# Altium schematic sheet projet_pcb_bluepill_f103.SchDoc
size A2
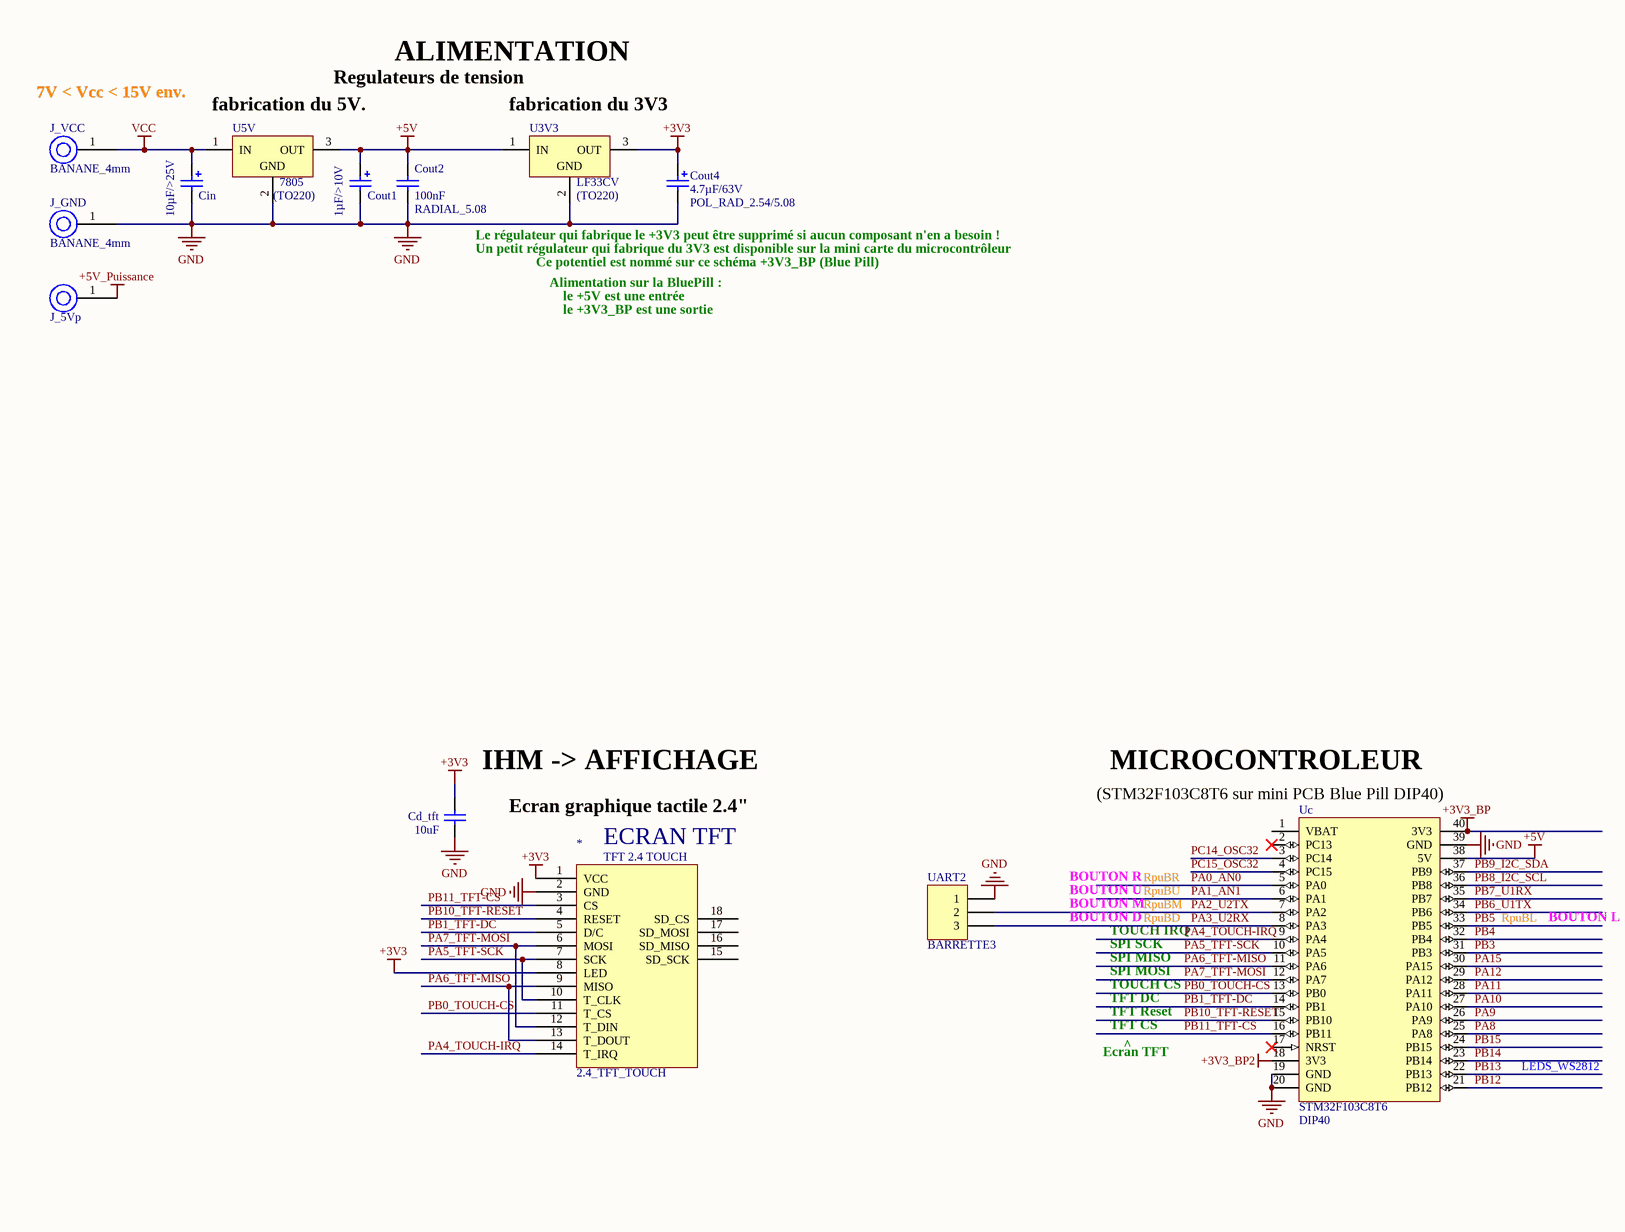
[diagram p0: projet_pcb_bluepill_f103.SchDoc, left]
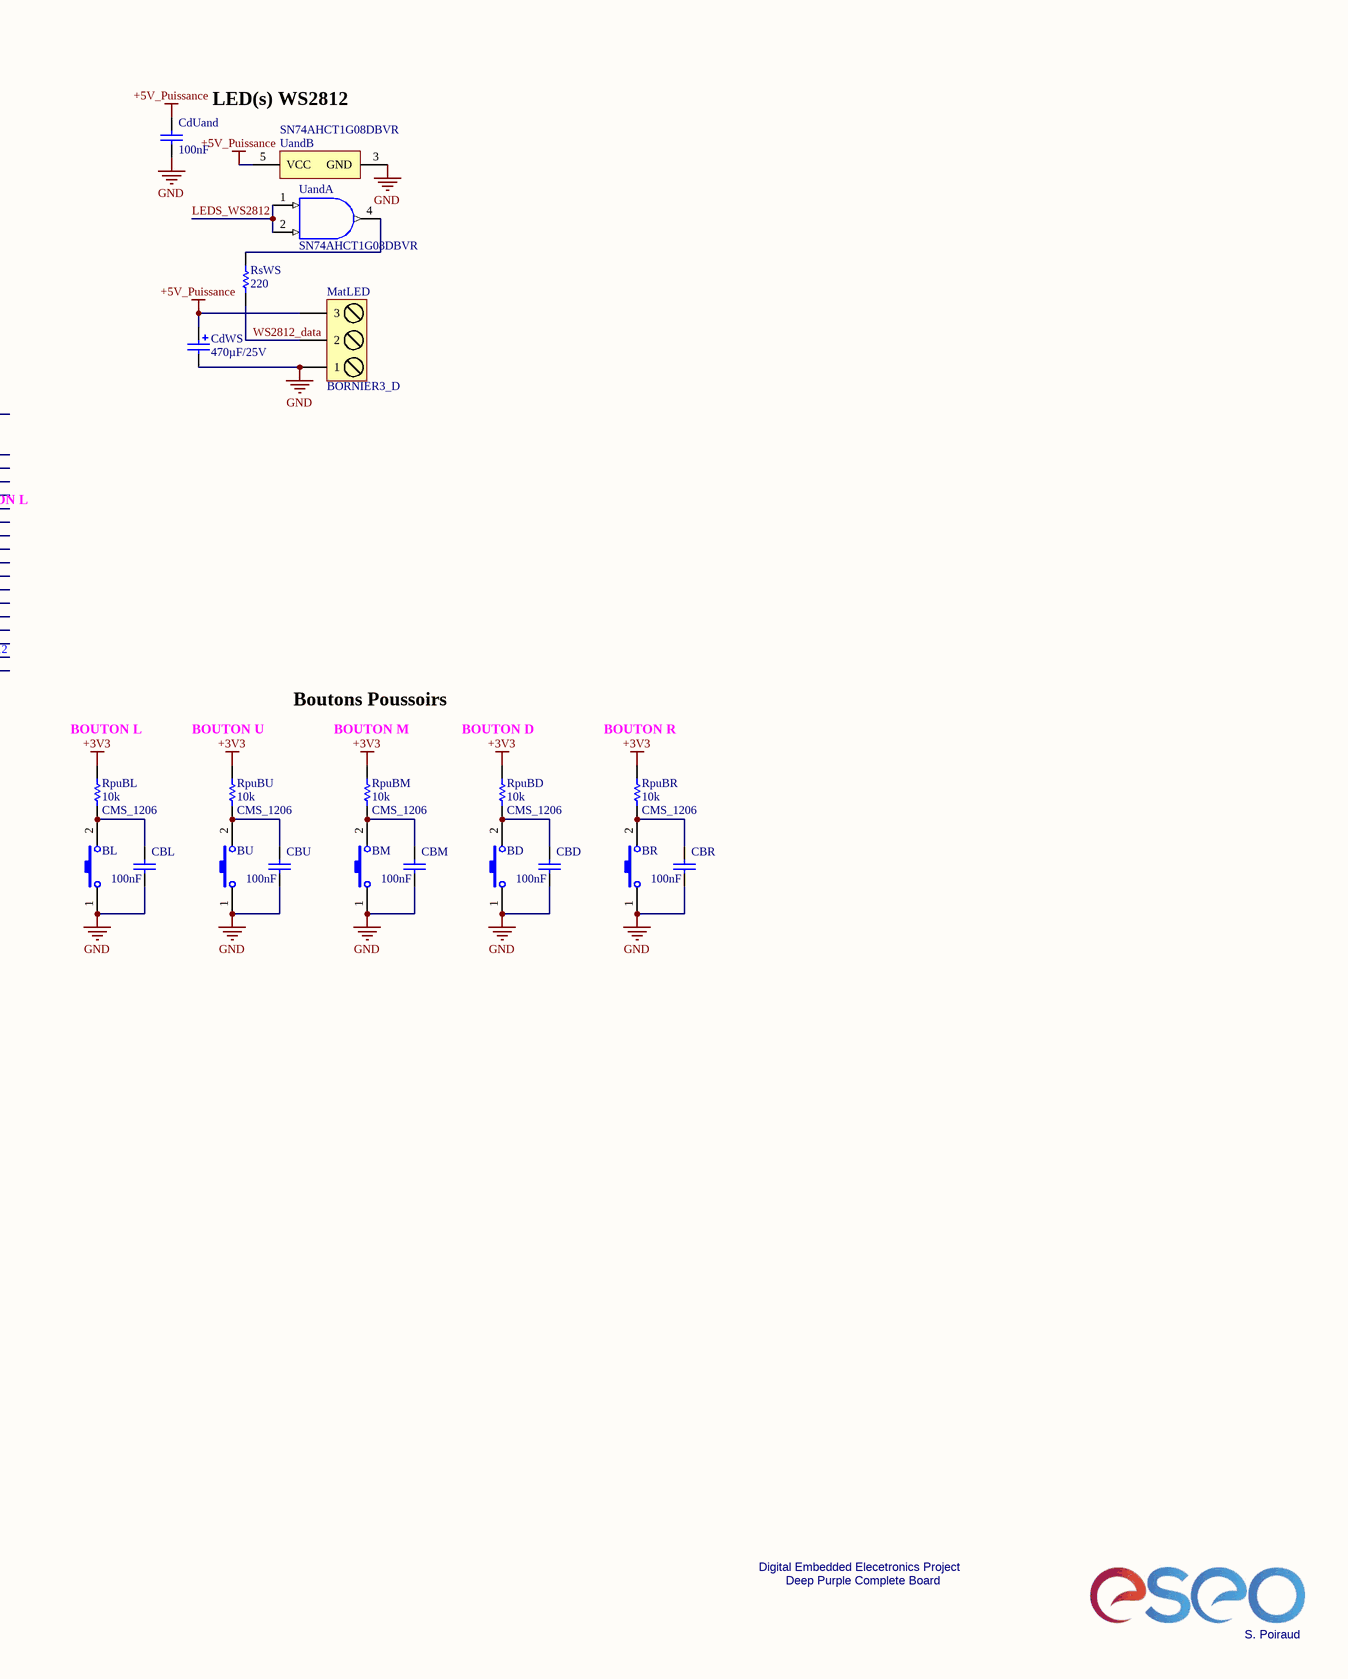
[diagram p1: projet_pcb_bluepill_f103.SchDoc, right]

## Parts
*  2.4_TFT_TOUCH  [2.4_TFT_TOUCH]
BD  BOUTON_POUSSOIR_MINIATURE_TRAVERSANT  [BOUTON_POUSSE_PLAT_6x6]  (value not drawn)
BL  BOUTON_POUSSOIR_MINIATURE_TRAVERSANT  [BOUTON_POUSSE_PLAT_6x6]  (value not drawn)
BM  BOUTON_POUSSOIR_MINIATURE_TRAVERSANT  [BOUTON_POUSSE_PLAT_6x6]  (value not drawn)
BR  BOUTON_POUSSOIR_MINIATURE_TRAVERSANT  [BOUTON_POUSSE_PLAT_6x6]  (value not drawn)
BU  BOUTON_POUSSOIR_MINIATURE_TRAVERSANT  [BOUTON_POUSSE_PLAT_6x6]  (value not drawn)
CBD  value 100nF  [C0805_N]  (hidden comment: Condensateur 0805)
CBL  value 100nF  [C0805_N]  (hidden comment: Condensateur 0805)
CBM  value 100nF  [C0805_N]  (hidden comment: Condensateur 0805)
CBR  value 100nF  [C0805_N]  (hidden comment: Condensateur 0805)
CBU  value 100nF  [C0805_N]  (hidden comment: Condensateur 0805)
Cd_tft  10uF  [CONDENSATEUR_POLARISE_ELECTROLYTIQUE_RADIAL_2.54/5.08]
CdUand  value 100nF  [C0805_N]  (hidden comment: CONDENSATEUR_CER_RAD_5.08)
CdWS  value 470µF/25V  [CONDENSATEUR_POLARISE_ELECTROLYTIQUE_RADIAL_5.08/10.16]  (hidden comment: CONDENSATEUR_POL_ELECTROLY_RAD_5.08/10.16)
Cin  value 10µF/>25V  [CONDENSATEUR_POLARISE_ELECTROLYTIQUE_RADIAL_2.0/5.08]  (hidden comment: CONDENSATEUR_POL_ELECTROLY_RAD_2.0/5.08)
Cout1  value 1µF/>10V  [CONDENSATEUR_POLARISE_ELECTROLYTIQUE_RADIAL_2.0/5.08]  (hidden comment: CONDENSATEUR_POL_ELECTROLY_RAD_2.0/5.08)
Cout2  value 100nF  Type: RADIAL_5.08  [CONDENSATEUR_CERAMIQUE_RADIAL_5.08]  (hidden comment: CONDENSATEUR_CER_RAD_5.08)
Cout4  value 4.7µF/63V  Type: POL_RAD_2.54/5.08  [CONDENSATEUR_POLARISE_ELECTROLYTIQUE_RADIAL_2.54/5.08]  (hidden comment: CONDENSATEUR_POL_ELECTROLY_RAD_2.54/5.08)
J_5Vp  DOUILLE BANANE 4mm  [DOUILLE_BANANE_4mm]  (value not drawn)
J_GND  Type: BANANE_4mm  [DOUILLE_BANANE_4mm]  (hidden comment: DOUILLE BANANE 4mm)
J_VCC  Type: BANANE_4mm  [DOUILLE_BANANE_4mm]  (hidden comment: DOUILLE BANANE 4mm)
MatLED  Type: BORNIER3_D  [BORNIER3_A_VIS]  (hidden comment: BORNIER3 DROIT A VIS)
RpuBD  value 10k  Type: CMS_1206  [RESISTANCE_CMS_1206]  (hidden comment: RESISTANCE_CMS_1206)
RpuBL  value 10k  Type: CMS_1206  [RESISTANCE_CMS_1206]  (hidden comment: RESISTANCE_CMS_1206)
RpuBM  value 10k  Type: CMS_1206  [RESISTANCE_CMS_1206]  (hidden comment: RESISTANCE_CMS_1206)
RpuBR  value 10k  Type: CMS_1206  [RESISTANCE_CMS_1206]  (hidden comment: RESISTANCE_CMS_1206)
RpuBU  value 10k  Type: CMS_1206  [RESISTANCE_CMS_1206]  (hidden comment: RESISTANCE_CMS_1206)
RsWS  220  [R1206_N]
U3V3  Type: LF33CV  Package: (TO220)  [REGULATEUR_TO220_78XX]  (hidden comment: REGULATEUR_TO220_78XX)
U5V  Type: 7805  Package: (TO220)  [REGULATEUR_TO220_78XX]  (hidden comment: REGULATEUR_TO220_78XX)
Uand  SN74AHCT1G08DBVR  [DBV0005A_N]  (parts A,B of 2)
UART2  BARRETTE3  [HDR1X3]
Uc  Type: STM32F103C8T6  Package: DIP40  [STM32F103C8T6_DIP40]  (hidden comment: STM32F103C8T6/PCB_DIP40)

## Nets
+3V3: *.1(VCC) *.8(LED) Cd_tft.1 Cout4.1 RpuBD.2 RpuBL.2 RpuBM.2 RpuBR.2 RpuBU.2 U3V3.3(OUT)
+3V3_BP: Uc.40(3V3)
+3V3_BP2: Uc.18(3V3)
+5V: Cout1.1 Cout2.2 U3V3.1(IN) U5V.3(OUT) Uc.38(5V)
+5V_Puissance: CdUand.2 CdWS.1 J_5Vp.1 MatLED.3 Uand.5(VCC)
GND: *.2(GND) BD.1 BL.1 BM.1 BR.1 BU.1 CBD.1 CBL.1 CBM.1 CBR.1 CBU.1 Cd_tft.2 CdUand.1 CdWS.2 Cin.2 Cout1.2 Cout2.1 Cout4.2 J_GND.1 MatLED.1 U3V3.2(GND) U5V.2(GND) Uand.3(GND) UART2.1 Uc.19(GND) Uc.20(GND) Uc.39(GND)
VCC: Cin.1 J_VCC.1 U5V.1(IN)
LEDS_WS2812: Uand.1(A) Uand.2(B) Uc.22(PB13)  [also labelled PB13]
PA0_AN0: Uc.5(PA0)  [also labelled RpuBR]
PA1_AN1: Uc.6(PA1)  [also labelled RpuBU]
PA2_U2TX: UART2.2 Uc.7(PA2)  [also labelled RpuBM]
PA3_U2RX: UART2.3 Uc.8(PA3)  [also labelled RpuBD]
PA4_TOUCH-IRQ: *.14(T_IRQ) Uc.9(PA4)
PA5_TFT-SCK: *.7(SCK) *.10(T_CLK) Uc.10(PA5)
PA6_TFT-MISO: *.9(MISO) *.13(T_DOUT) Uc.11(PA6)
PA7_TFT-MOSI: *.6(MOSI) *.12(T_DIN) Uc.12(PA7)
PA8: Uc.25(PA8)
PA9: Uc.26(PA9)
PA10: Uc.27(PA10)
PA11: Uc.28(PA11)
PA12: Uc.29(PA12)
PA15: Uc.30(PA15)
PB0_TOUCH-CS: *.11(T_CS) Uc.13(PB0)
PB1_TFT-DC: *.5(D/C) Uc.14(PB1)
PB3: Uc.31(PB3)
PB4: Uc.32(PB4)
PB5: Uc.33(PB5)  [also labelled RpuBL]
PB6_U1TX: Uc.34(PB6)
PB7_U1RX: Uc.35(PB7)
PB8_I2C_SCL: Uc.36(PB8)
PB9_I2C_SDA: Uc.37(PB9)
PB10_TFT-RESET: *.4(RESET) Uc.15(PB10)
PB11_TFT-CS: *.3(CS) Uc.16(PB11)
PB12: Uc.21(PB12)
PB14: Uc.23(PB14)
PB15: Uc.24(PB15)
PC14_OSC32: Uc.3(PC14)
PC15_OSC32: Uc.4(PC15)
WS2812_data: MatLED.2 RsWS.1
NetBD_2: BD.2 CBD.2 RpuBD.1
NetBL_2: BL.2 CBL.2 RpuBL.1
NetBM_2: BM.2 CBM.2 RpuBM.1
NetBR_2: BR.2 CBR.2 RpuBR.1
NetBU_2: BU.2 CBU.2 RpuBU.1
NetRsWS_2: RsWS.2 Uand.4(Y)

Not connected (* = marked no-connect by the designer): * 15(SD_SCK) 16(SD_MISO) 17(SD_MOSI) 18(SD_CS); Uc 1(VBAT) 2(PC13)* 17(NRST)*

## Notes on the sheet
- 7V < Vcc < 15V env.
- Regulateurs de tension
- ALIMENTATION
- (near U5V) fabrication du 5V.
- (near U3V3) fabrication du 3V3
- Le régulateur qui fabrique le +3V3 peut être supprimé si aucun composant n'en a besoin !
- Un petit régulateur qui fabrique du 3V3 est disponible sur la mini carte du microcontrôleur
- Ce potentiel est nommé sur ce schéma +3V3_BP (Blue Pill)
- Alimentation sur la BluePill :
- le +5V est une entrée
- le +3V3_BP est une sortie
- LED(s) WS2812
- (near Cd_tft) IHM -> AFFICHAGE
- MICROCONTROLEUR
- Ecran graphique tactile 2.4"
- (near Uc) (STM32F103C8T6 sur mini PCB Blue Pill DIP40)
- (near *) ECRAN TFT
- BOUTON R
- BOUTON U
- BOUTON M
- BOUTON D
- SPI SCK
- SPI MISO
- SPI MOSI
- TOUCH IRQ
- BOUTON L
- TOUCH CS
- TFT DC
- TFT Reset
- TFT CS
- ^
- Ecran TFT
- (near RpuBL) BOUTON L
- (near RpuBU) BOUTON U
- Boutons Poussoirs
- (near RpuBM) BOUTON M
- (near RpuBD) BOUTON D
- (near RpuBR) BOUTON R
- Digital Embedded Elecetronics Project
- Deep Purple Complete Board
- S. Poiraud
- Title
- Size:
- Date:
- File:
- A2
- Number:
- Time:
- Revision:
- Sheet
- of
- (in symbol 2.4_TFT_TOUCH) TFT 2.4 TOUCH

## Library data of the parts
BD BL BM BR BU = BOUTON_POUSSOIR_MINIATURE_TRAVERSANT: BOUTON POUSSOIR MINIATURE TRAVERSANT ON/OFF; Type: B_POUSS_MINI_T
CBD CBL CBM CBR CBU = CONDENSATEUR_CER_RAD_5.08: Type: RADIAL_5.08
Cd_tft = Condensateur: Capacitor; Published: 8-Jun-2000; LatestRevisionDate: 17-Jul-2002; LatestRevisionNote: Re-released for DXP Platform.; PackageReference: RAD-0.3; Publisher: Altium Limited
CdUand = : CONDENSATEUR_CER_CMS_0805; Type: RADIAL_5.08
CdWS = CONDENSATEUR_POL_ELECTROLY_RAD_5.08/10.16: CONDENSATEUR POLARISE ELECTROLYTIQUE RADIAL 5.08/10.16; Type: POL_RAD_5.08/10.16
Cin Cout1 = CONDENSATEUR_POL_ELECTROLY_RAD_2.0/5.08: CONDENSATEUR POLARISE ELECTROLYTIQUE RADIAL 2.0/5.08; Type: POL_RAD_2.0/5.08
Cout2 = CONDENSATEUR_CER_RAD_5.08: CONDENSATEUR TRAVERSANT CERAMIQUE RADIAL 5.08mm
Cout4 = CONDENSATEUR_POL_ELECTROLY_RAD_2.54/5.08: CONDENSATEUR POLARISE ELECTROLYTIQUE RADIAL 2.54/5.08
J_5Vp J_GND J_VCC = DOUILLE_BANANE_4mm: DOUILLE BANANE 4 mm
  J_5Vp: Type: BANANE_4mm
MatLED = BORNIER3_DROIT_A VIS: BORNIER 3 PLOTS DROIT A VIS 5.08mm
RpuBD RpuBL RpuBM RpuBR RpuBU = RESISTANCE_CMS_1206: RESISTANCE CMS 1206
RsWS = Resistor: Published: 8-Jun-2000; LatestRevisionDate: 17-Jul-2002; LatestRevisionNote: Re-released for DXP Platform.; PackageReference: AXIAL-0.5; Publisher: Altium Limited
U3V3 U5V = REGULATEUR_TO220_78XX: REGULATEUR DE TENSION POSITIVE 78XX BOITIER TO220
Uand = SN74AHCT1G08DBVR: Single 2-Input Positive-AND Gate, DBV0005A, LARGE T&R; Manufacturer: Texas Instruments; VCC(Min)(V): 2; VCC(Max)(V): 5.5; Output Type: CMOS; ICC @ Nom Voltage(Max)(mA): 0.01; Bits(#): 1; F @ Nom Voltage(Max)(Mhz): 75; Rating: Catalog; Technology Family: AHCT; Voltage(Nom)(V): 5; Schmitt Trigger: No; Output Drive (IOL/IOH)(Max)(mA): 8/-8; tpd @ Nom Voltage(Max)(ns): 7.1; Logic: True; Gate Type: AND; DatasheetVersion: SCLS315P; PackageReference: DBV0005A; Supplier 1: Mouser; Supplier Part Number 1: 595-SN74AHCT1G08DBVR; Supplier 2: Digi-Key; Supplier Part Number 2: 296-1113-2-ND; Supplier 3: Digi-Key; Supplier Part Number 3: 296-1113-1-ND; Supplier 4: Digi-Key; Supplier Part Number 4: 296-1113-6-ND; Generic Part Number: SN74AHCT1G08; Input Type: CMOS; Operating Temperature Range(C): -40 to 125; Sub-Family: AND Gate; 3-State Output: No; PartNumber: SN74AHCT1G08DBVR; ComponentLink1Description: Manufacturer URL; ComponentLink1URL: http://www.ti.com/; ComponentLink2Description: Datasheet; ComponentLink2URL: http://www.ti.com/lit/ds/symlink/sn74ahct1g08.pdf
UART2 = BARRETTE3: Header, 3-Pin; LatestRevisionDate: 17-Jul-2002; LatestRevisionNote: Re-released for DXP Platform.; Publisher: Altium Limited
Uc = STM32F103C8T6/PCB_DIP40: MICROCONTROLEUR 32 BITS - 72MHz - 34 I/O - 64 KO : FLASH - 20KO RAM - 10 CANAUX A/D 12 BITS - DIP40 - UART, SPI, I2C, USB, CAN